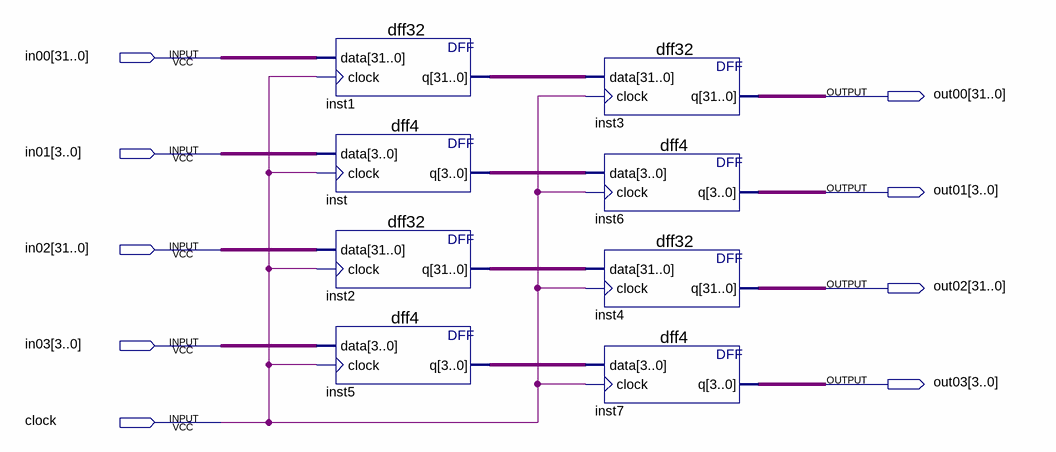
[diagram p0: schematic sheet]
// Quartus schematic Register_Set2.bdf as structural Verilog: 8 symbols, 9 pins
module Register_Set2 (
  input  [31:0] in00,
  input  [3:0] in01,
  input  [31:0] in02,
  input  [3:0] in03,
  input  clock,
  output [31:0] out00,
  output [3:0] out01,
  output [31:0] out02,
  output [3:0] out03
);

  wire [3:0] inst5_q, inst_q;
  wire [31:0] inst1_q, inst2_q;

  dff32 inst1 (.data(in00), .clock(clock), .q(inst1_q));
  dff4 inst (.data(in01), .clock(clock), .q(inst_q));
  dff32 inst2 (.data(in02), .clock(clock), .q(inst2_q));
  dff4 inst5 (.data(in03), .clock(clock), .q(inst5_q));
  dff32 inst3 (.data(inst1_q), .clock(clock), .q(out00));
  dff4 inst6 (.data(inst_q), .clock(clock), .q(out01));
  dff32 inst4 (.data(inst2_q), .clock(clock), .q(out02));
  dff4 inst7 (.data(inst5_q), .clock(clock), .q(out03));
endmodule
